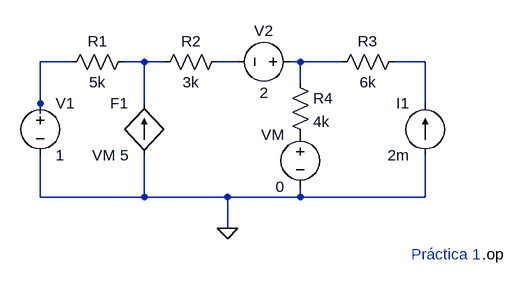
[diagram p0: schematic 32898935B.asc]
32898935B.asc, the LTspice schematic file:
Version 4
SHEET 1 880 680
WIRE -64 -176 -112 -176
WIRE 48 -176 16 -176
WIRE 80 -176 48 -176
WIRE 192 -176 160 -176
WIRE 288 -176 272 -176
WIRE 352 -176 288 -176
WIRE 480 -176 432 -176
WIRE 288 -144 288 -176
WIRE -112 -112 -112 -176
WIRE 48 -112 48 -176
WIRE 480 -112 480 -176
WIRE -112 -96 -112 -112
WIRE -112 32 -112 -32
WIRE 48 32 48 -32
WIRE 48 32 -112 32
WIRE 176 32 48 32
WIRE 288 32 288 16
WIRE 288 32 176 32
WIRE 480 32 480 -32
WIRE 480 32 288 32
WIRE 176 80 176 32
FLAG 176 80 0
SYMBOL voltage -112 -128 R0
WINDOW 123 0 0 Left 0
WINDOW 39 0 0 Left 0
SYMATTR InstName V1
SYMATTR Value 1
SYMBOL voltage 288 -176 R90
WINDOW 0 -32 56 VBottom 2
WINDOW 3 32 56 VTop 2
WINDOW 123 0 0 Left 0
WINDOW 39 0 0 Left 0
SYMATTR InstName V2
SYMATTR Value 2
SYMBOL res 32 -192 R90
WINDOW 0 0 56 VBottom 2
WINDOW 3 32 56 VTop 2
SYMATTR InstName R1
SYMATTR Value 5k
SYMBOL res 176 -192 R90
WINDOW 0 0 56 VBottom 2
WINDOW 3 32 56 VTop 2
SYMATTR InstName R2
SYMATTR Value 3k
SYMBOL res 448 -192 R90
WINDOW 0 0 56 VBottom 2
WINDOW 3 32 56 VTop 2
SYMATTR InstName R3
SYMATTR Value 6k
SYMBOL res 272 -160 R0
SYMATTR InstName R4
SYMATTR Value 4k
SYMBOL f 48 -32 R180
WINDOW 0 24 80 Left 2
WINDOW 3 24 0 Left 2
SYMATTR InstName F1
SYMATTR Value VM 5
SYMBOL current 480 -32 R180
WINDOW 0 24 80 Left 2
WINDOW 3 24 0 Left 2
WINDOW 123 0 0 Left 0
WINDOW 39 0 0 Left 0
SYMATTR InstName I1
SYMATTR Value 2m
SYMBOL voltage 288 -80 M0
WINDOW 123 0 0 Left 0
WINDOW 39 0 0 Left 0
SYMATTR InstName VM
SYMATTR Value 0
TEXT 568 120 Left 2 !.op
TEXT 512 120 Center 2 ;Práctica 1

The netlist it stands for:
* 32898935B.asc
V1 N001 0 1
V2 N004 N003 2
R1 N002 N001 5k
R2 N003 N002 3k
R3 N005 N004 6k
R4 N004 P001 4k
F1 0 N002 VM 5
I1 0 N005 2m
VM P001 0 0
.op
* Práctica 1
.backanno
.end